# Altium schematic sheet BreakoutPins.SchDoc
size A; SheetNumber: 2; SheetTotal: 2
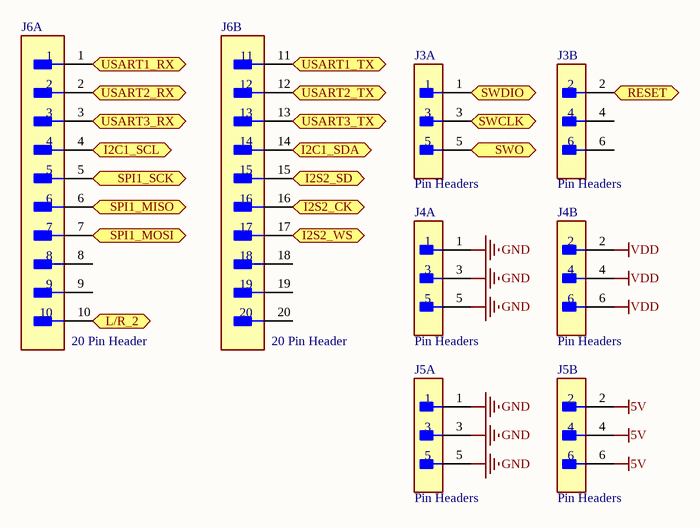
[diagram p0: BreakoutPins.SchDoc]

## Parts
J3  Pin Headers  [FP-M20-9980346-MFG]  (parts A,B of 2)
J4  Pin Headers  [FP-M20-9980346-MFG]  (parts A,B of 2)
J5  Pin Headers  [FP-M20-9980346-MFG]  (parts A,B of 2)
J6  20 Pin Header  [FP-TSW-110-08-G-D-MFG]  (parts A,B of 2)

## Ports
I2C1_SCL (bidir), I2C1_SDA (bidir), I2S2_CK (bidir), I2S2_SD (bidir), I2S2_WS (bidir), L/R_2 (bidir), RESET (bidir), SPI1_MISO (bidir), SPI1_MOSI (bidir), SPI1_SCK (bidir), SWCLK (bidir), SWDIO (bidir), SWO (bidir), USART1_RX (bidir), USART1_TX (bidir), USART2_RX (bidir), USART2_TX (bidir), USART3_RX (bidir), USART3_TX (bidir)

## Nets
5V: J5.2 J5.4 J5.6
GND: J4.1 J4.3 J4.5 J5.1 J5.3 J5.5
VDD: J4.2 J4.4 J4.6
I2C1_SCL: J6.4 ; port I2C1_SCL
I2C1_SDA: J6.14 ; port I2C1_SDA
I2S2_CK: J6.16 ; port I2S2_CK
I2S2_SD: J6.15 ; port I2S2_SD
I2S2_WS: J6.17 ; port I2S2_WS
L/R_2: J6.10 ; port L/R_2
RESET: J3.2 ; port RESET
SPI1_MISO: J6.6 ; port SPI1_MISO
SPI1_MOSI: J6.7 ; port SPI1_MOSI
SPI1_SCK: J6.5 ; port SPI1_SCK
SWCLK: J3.3 ; port SWCLK
SWDIO: J3.1 ; port SWDIO
SWO: J3.5 ; port SWO
USART1_RX: J6.1 ; port USART1_RX
USART1_TX: J6.11 ; port USART1_TX
USART2_RX: J6.2 ; port USART2_RX
USART2_TX: J6.12 ; port USART2_TX
USART3_RX: J6.3 ; port USART3_RX
USART3_TX: J6.13 ; port USART3_TX

Not connected (* = marked no-connect by the designer): J3 4 6; J6 8 9 18 19 20

## Library data of the parts
J3-J5 = CMP-2000-06636-2: CONN HEADER VERT 6POS 2.54MM / M20-9980346; Manufacturer: Harwin; Current Rating: 3A; Number Of Contacts: 6; Conn Gender: Male; Conn Orientation: Vertical; Device Class L1: Connectors; ComponentLink2Description: Datasheet; Height: 8.99mm; Temperature Range High: +105°C; Contact Material: Tin,Nickel; RoHS: TRUE; Temperature Range Low: -40°C; ComponentLink2URL: https://cdn.harwin.com/pdfs/M20-998.pdf; Digikey Description: CONN HEADER VERT 6POS 2.54MM; Pitch: 2.54mm; Package: M20-9980346; Device Class L2: Headers and Wire Housings; Manufacturer Part Number: M20-9980346; Number Of Rows: 2; Category: Conn; Lead Free: Yes; Mouser Description: 2.54mm (0.1") Pitch DIL Vertical PC Tail Pin Header, 6.1mm mating pin height, tin, 3+3 contacts; Temperature: -40°C to +105°C; Device Class L3: unset; Octopart: https://octopart.com/m20-9980346-harwin-5436545; Automotive: No
J6 = CMP-02766-000083-1: CONN HEADER VERT 20POS 2.54MM / TSW-110-08-G-D; Manufacturer: Samtec; Conn Gender: Male; Number Of Contacts: 20; Conn Orientation: Straight; Lead Free: Yes; Category: Conn; Manufacturer Part Number: TSW-110-08-G-D; Temperature Range High: +125°C; Pitch: 2.54mm; Temperature: -55°C to +125°C; Automotive: No; Device Class L1: Connectors; ComponentLink2URL: http://suddendocs.samtec.com/prints/tsw-xxx-xx-xxx-x-xx-xxx-mkt.pdf; Temperature Range Low: -55°C; ComponentLink2Description: Datasheet; Height: 8.71mm; Number Of Rows: 2; Digikey Description: CONN HEADER VERT 20POS 2.54MM; Package: TSW-110-08-G-D; Device Class L3: unset; Contact Material: Gold,Nickel; Octopart: https://octopart.com/tsw-110-08-g-d-samtec-272555; Footprint Url: http://suddendocs.samtec.com/prints/tsw-xxx-xx-x-x-xx-xxx-footprint.pdf; RoHS: TRUE; Ipc Land Pattern Name: CAPAD1016W80L630D240; Device Class L2: Headers and Wire Housings